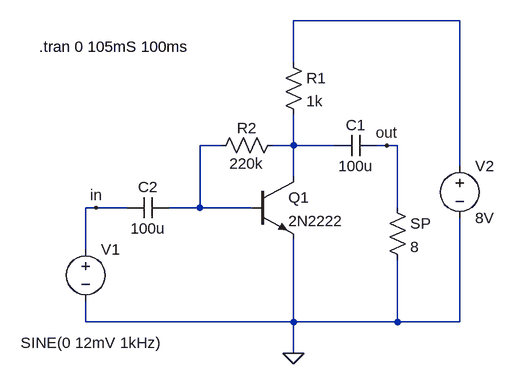
[diagram p0: schematic self-bias-amp.asc]
self-bias-amp.asc, the LTspice schematic file:
Version 4
SHEET 1 880 680
WIRE 496 -128 240 -128
WIRE 240 -64 240 -128
WIRE 128 64 96 64
WIRE 240 64 240 16
WIRE 240 64 208 64
WIRE 304 64 240 64
WIRE 384 64 368 64
WIRE 400 64 384 64
WIRE 496 96 496 -128
WIRE 240 112 240 64
WIRE -64 160 -80 160
WIRE -16 160 -64 160
WIRE 96 160 96 64
WIRE 96 160 48 160
WIRE 176 160 96 160
WIRE 400 160 400 64
WIRE -80 224 -80 160
WIRE -80 336 -80 304
WIRE 240 336 240 208
WIRE 240 336 -80 336
WIRE 400 336 400 240
WIRE 400 336 240 336
WIRE 496 336 496 176
WIRE 496 336 400 336
WIRE 240 384 240 336
FLAG 240 384 0
FLAG 384 64 out
FLAG -64 160 in
SYMBOL npn 176 112 R0
SYMATTR InstName Q1
SYMATTR Value 2N2222
SYMBOL voltage -80 208 R0
WINDOW 3 -100 160 Left 2
WINDOW 123 0 0 Left 2
WINDOW 39 0 0 Left 2
SYMATTR Value SINE(0 12mV 1kHz)
SYMATTR InstName V1
SYMBOL voltage 496 80 R0
WINDOW 123 0 0 Left 2
WINDOW 39 0 0 Left 2
SYMATTR InstName V2
SYMATTR Value 8V
SYMBOL res 224 -80 R0
SYMATTR InstName R1
SYMATTR Value 1k
SYMBOL res 224 48 R90
WINDOW 0 5 56 VBottom 2
WINDOW 3 28 56 VTop 2
SYMATTR InstName R2
SYMATTR Value 220k
SYMBOL cap 368 48 R90
WINDOW 0 0 32 VBottom 2
WINDOW 3 32 32 VTop 2
SYMATTR InstName C1
SYMATTR Value 100u
SYMBOL cap 48 144 R90
WINDOW 0 0 32 VBottom 2
WINDOW 3 32 32 VTop 2
SYMATTR InstName C2
SYMATTR Value 100u
SYMBOL res 384 144 R0
SYMATTR InstName SP
SYMATTR Value 8
TEXT -152 -88 Left 2 !.tran 0 105mS 100ms

The netlist it stands for:
* self-bias-amp.asc
Q1 N003 N002 0 0 2N2222
V1 in 0 SINE(0 12mV 1kHz)
V2 N001 0 8V
R1 N001 N003 1k
R2 N003 N002 220k
C1 out N003 100u
C2 N002 in 100u
R§SP out 0 8
.model NPN NPN
.model PNP PNP
.lib standard.bjt
.tran 0 105mS 100ms
.backanno
.end

* Results of the author's LTspice run, read from the files saved beside the schematic
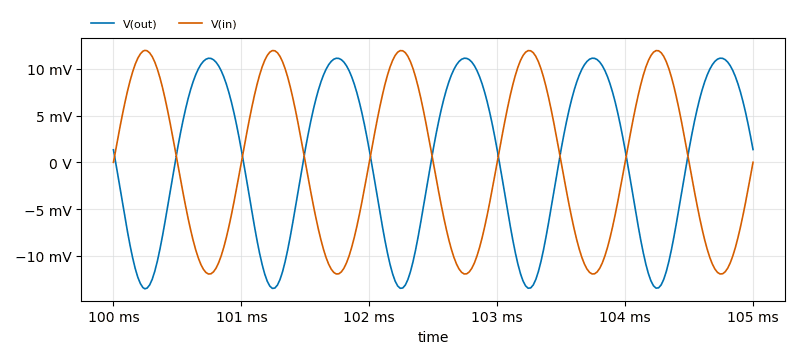
[diagram p1: Transient Analysis of self-bias-amp.asc, plotted from the saved traces]
* Transient Analysis, 1 run:
*   V(out): min -13.52 mV, max 11.13 mV, average 94.65 µV, rms 8.696 mV, last 1.364 mV
*   V(in): min -11.94 mV, max 11.96 mV, average 128.7 nV, rms 8.452 mV, last 0 V